# EAGLE schematic u2x (EAGLE 9.6.1)
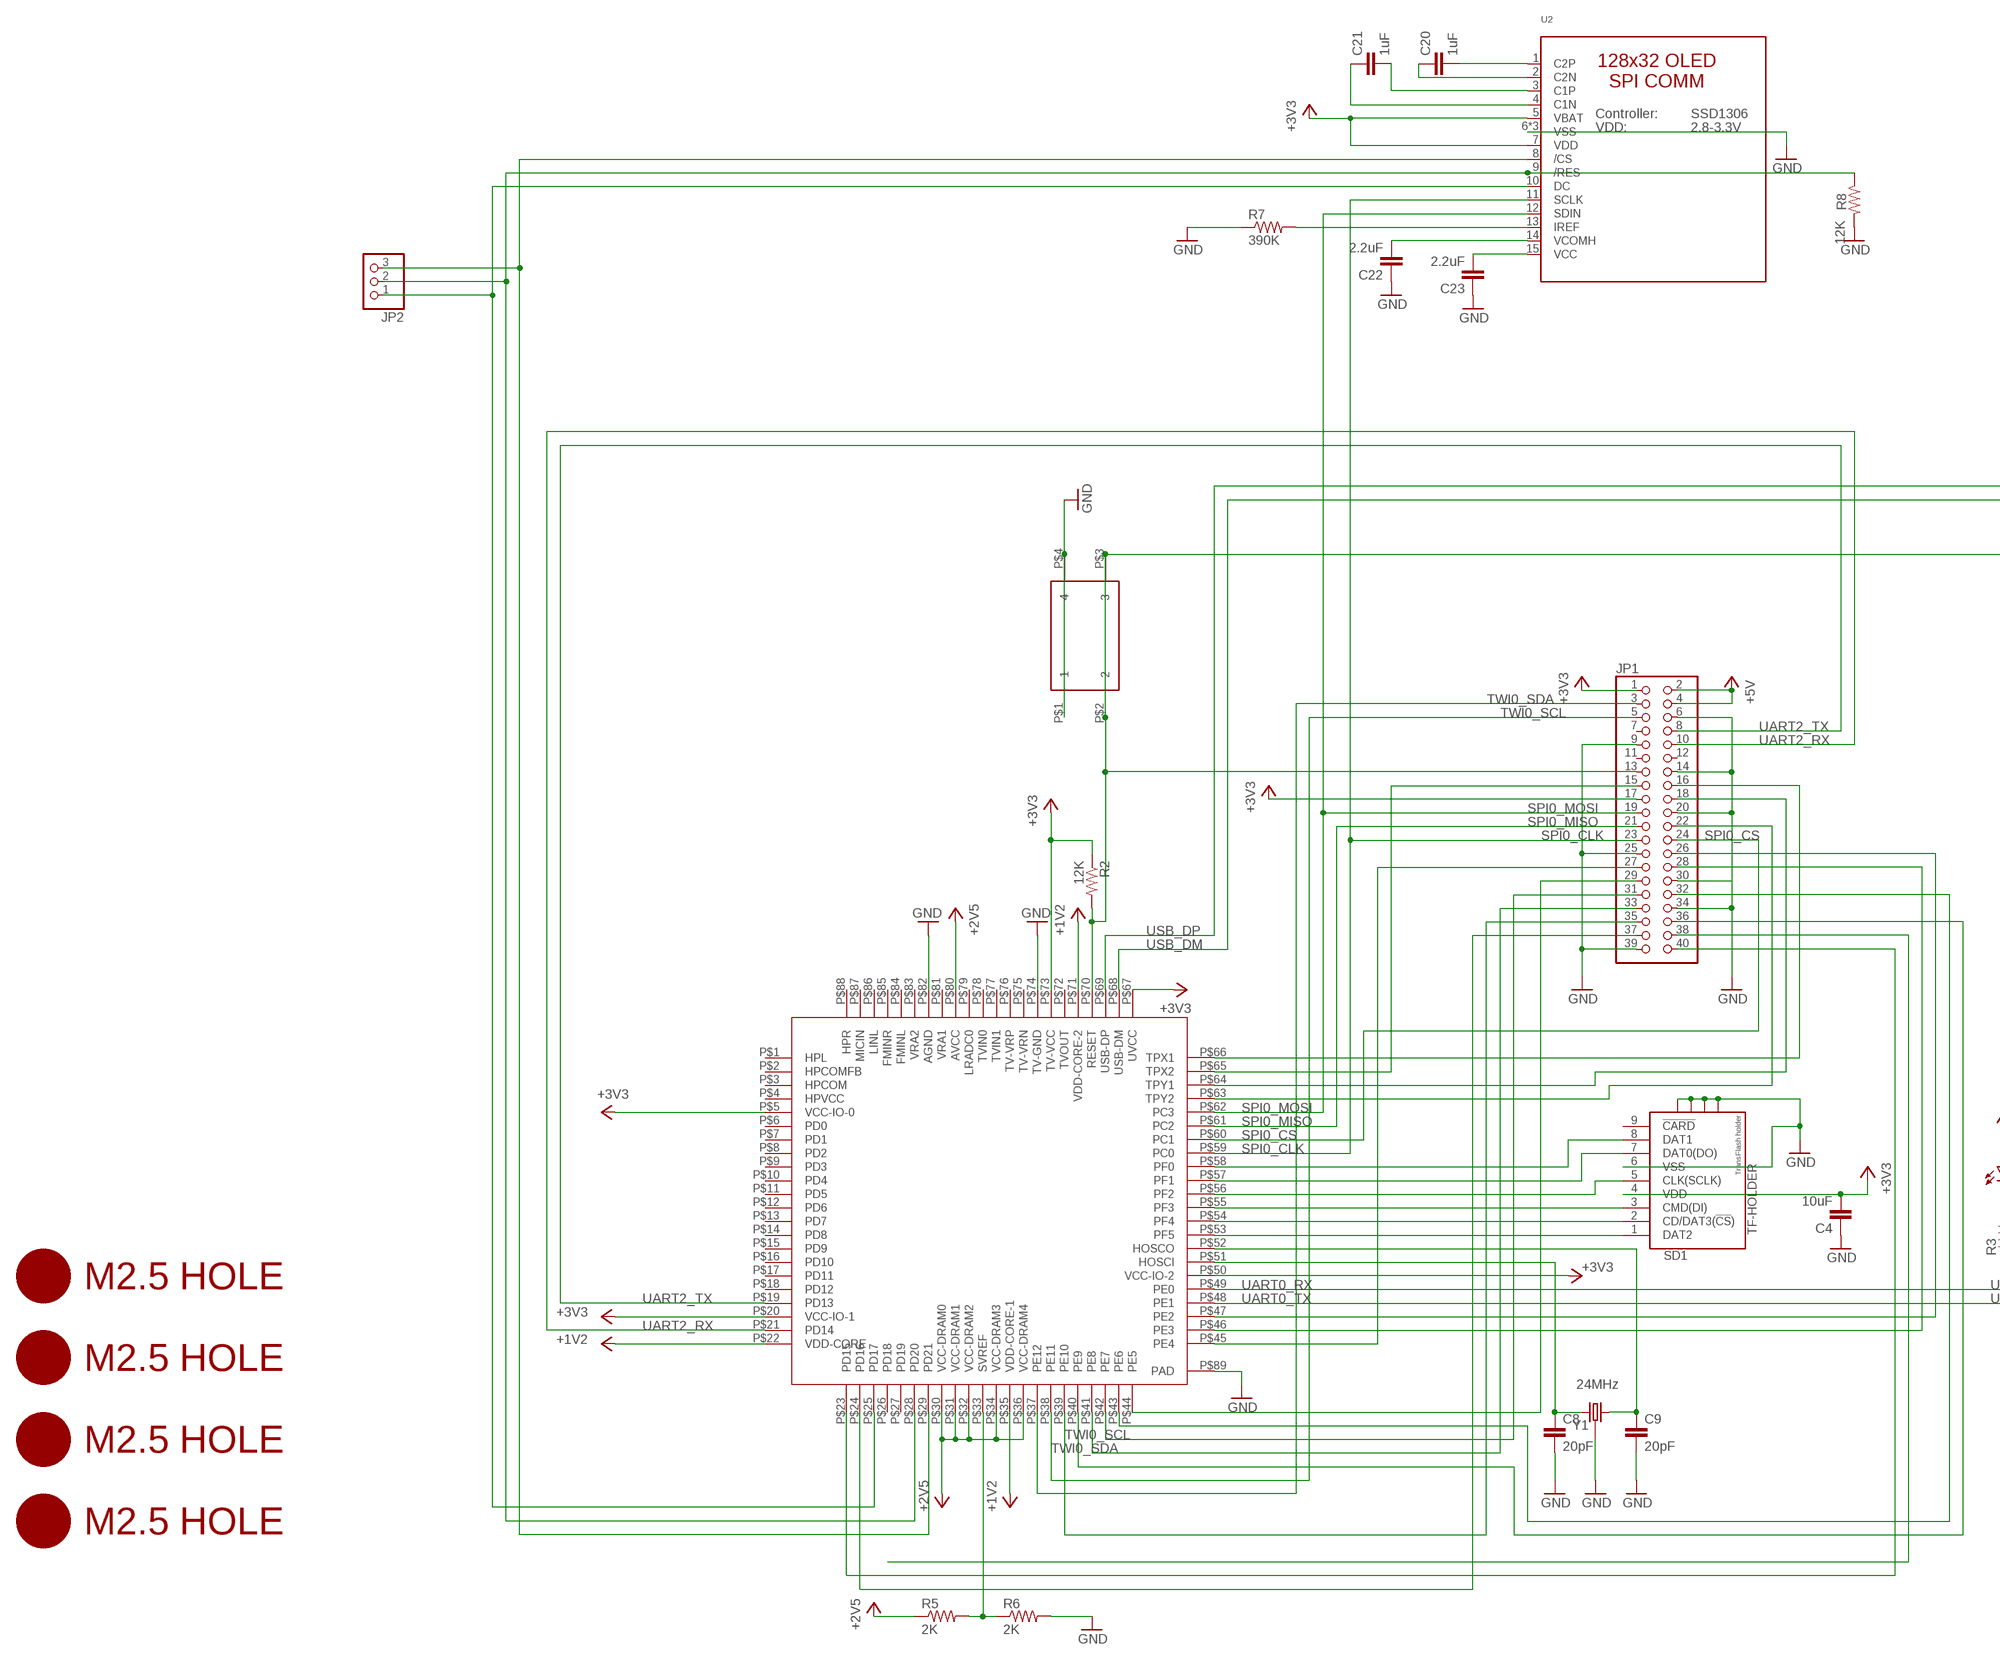
[diagram p0: schematic, sheet 1, part 1 of 2]
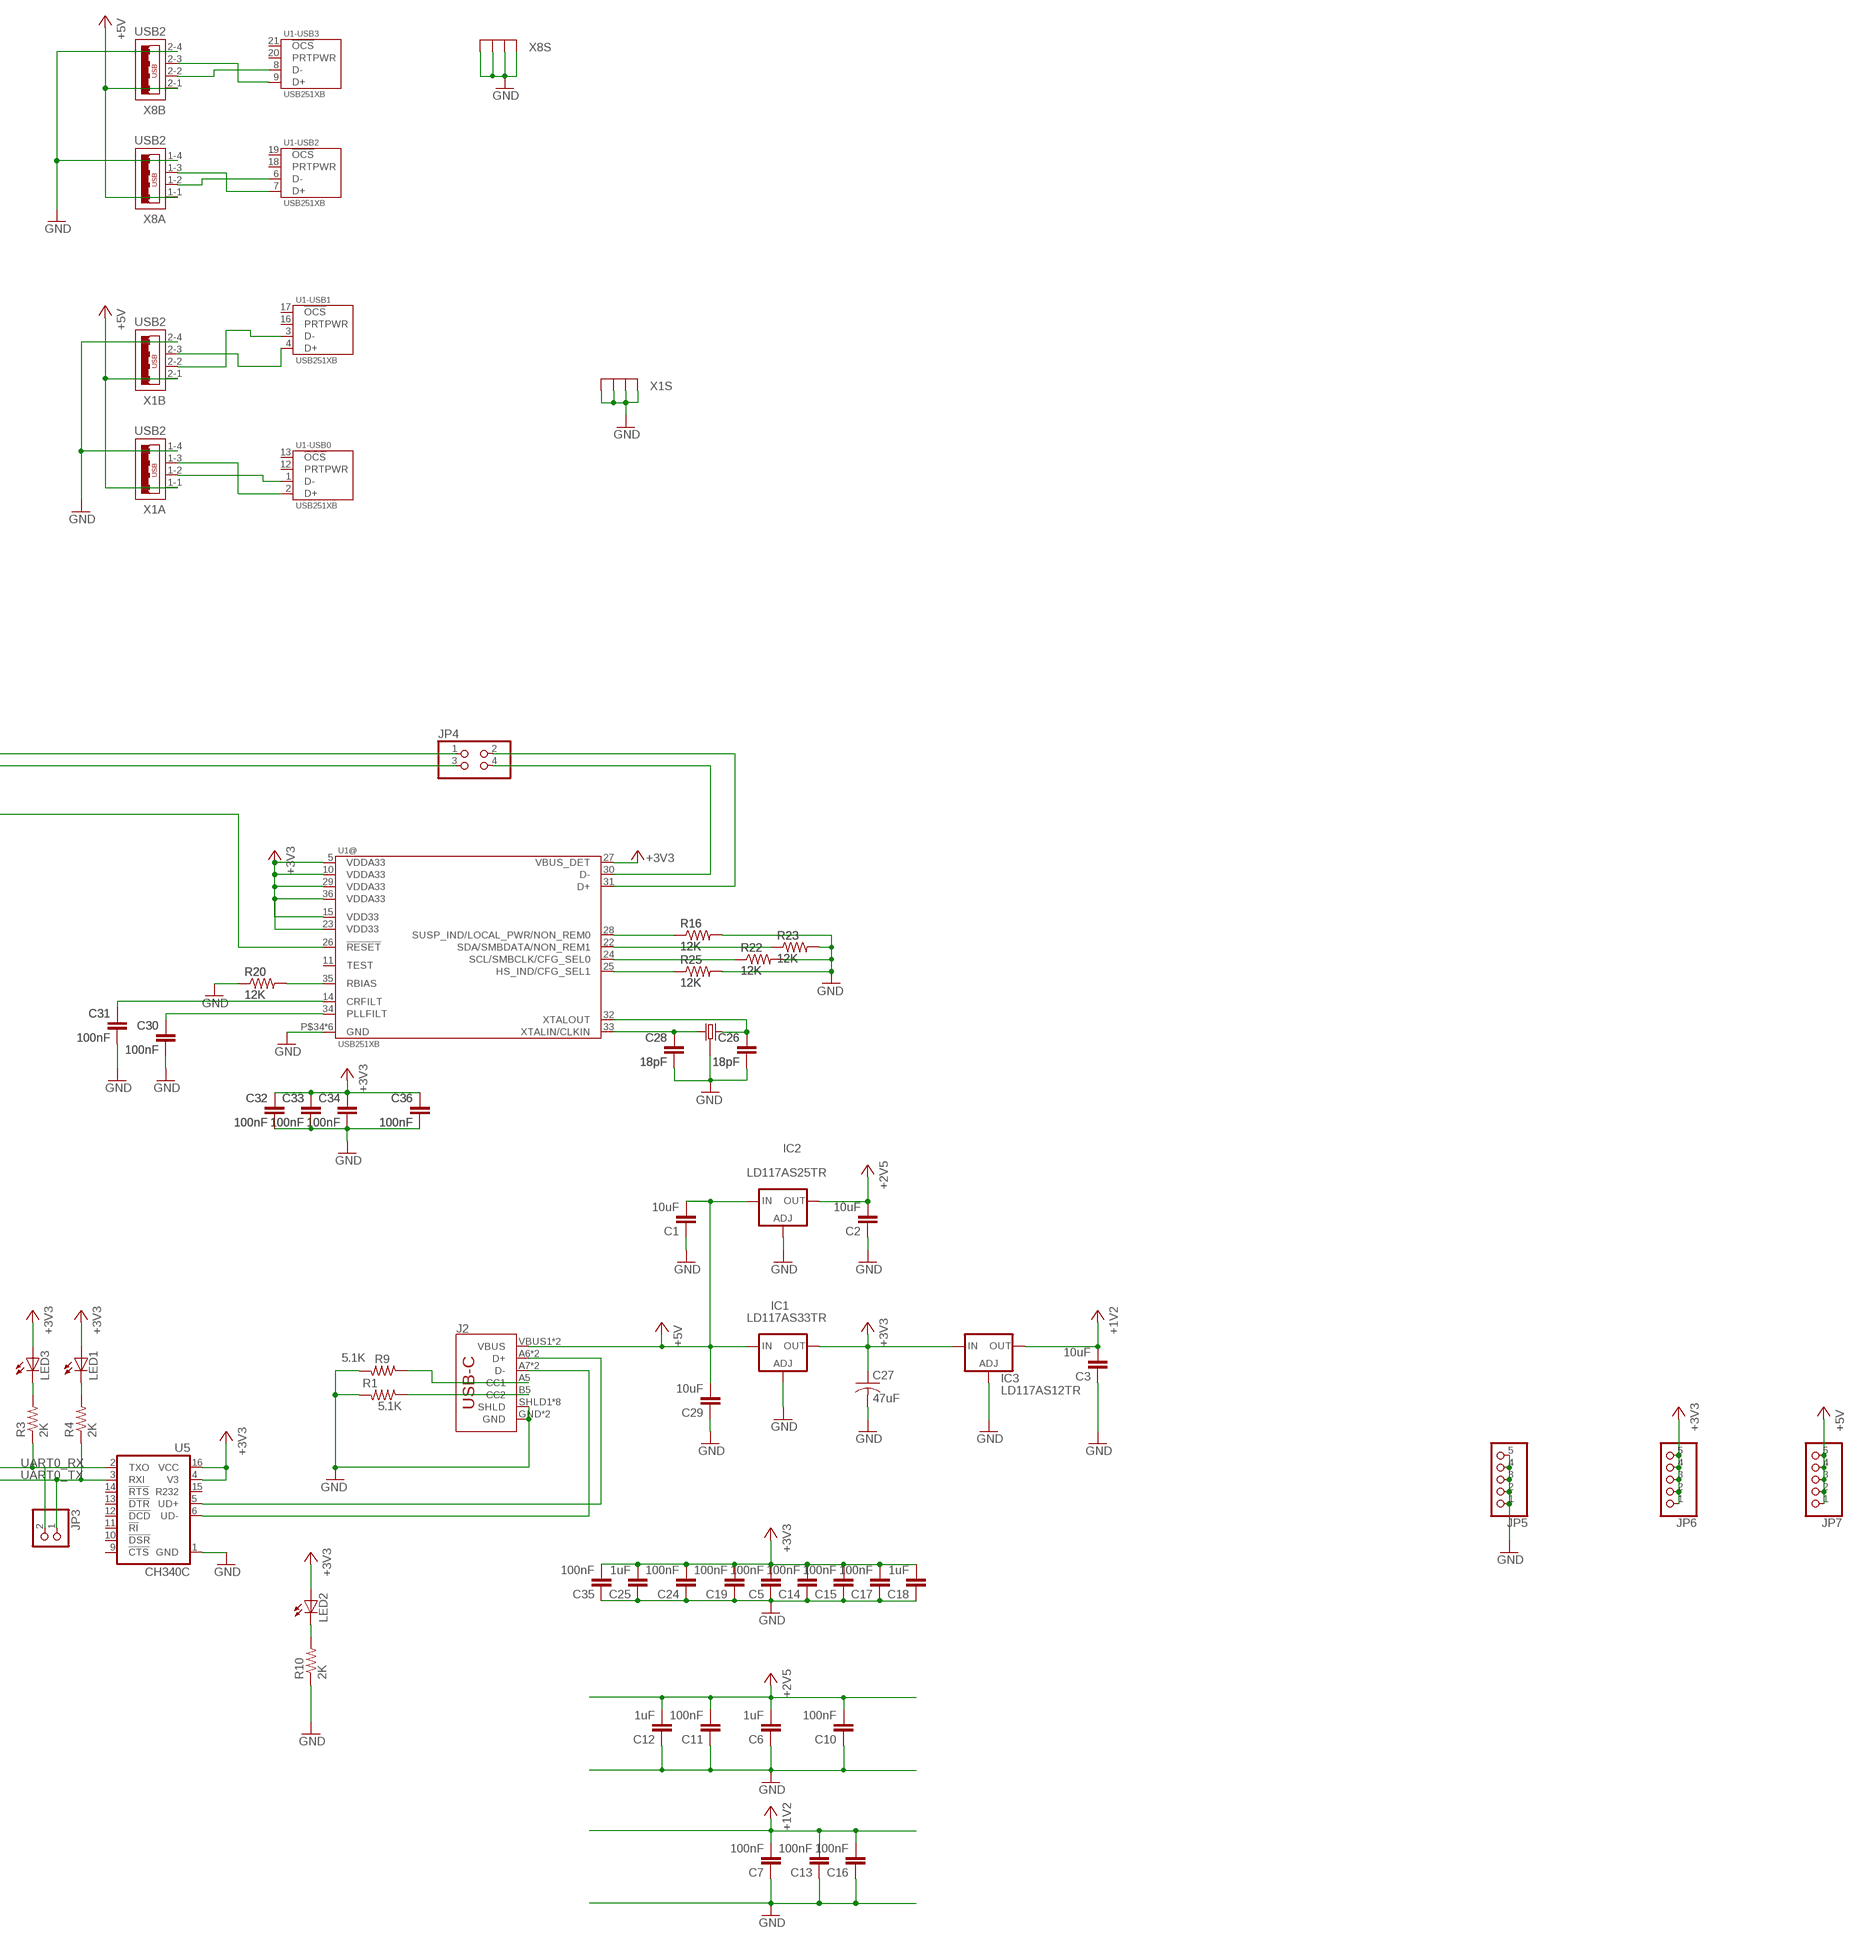
[diagram p1: schematic, sheet 1, part 2 of 2]

## Parts
C1  10uF  CAP0805  [0805]
C2  10uF  CAP0805  [0805]
C3  10uF  CAP0805  [0805]
C4  10uF  CAP0805  [0805]
C5  100nF  CAP0805  [0805]
C6  1uF  CAP0805  [0805]
C7  100nF  CAP0805  [0805]
C8  20pF  CAP0805  [0805]
C9  20pF  CAP0805  [0805]
C10  100nF  CAP0805  [0805]
C11  100nF  CAP0805  [0805]
C12  1uF  CAP0805  [0805]
C13  100nF  CAP0805  [0805]
C14  100nF  CAP0805  [0805]
C15  100nF  CAP0805  [0805]
C16  100nF  CAP0805  [0805]
C17  100nF  CAP0805  [0805]
C18  1uF  CAP0805  [0805]
C19  100nF  CAP0805  [0805]
C20  1uF  CAP0805  [0805]
C21  1uF  CAP0805  [0805]
C22  2.2uF  CAP0805  [0805]
C23  2.2uF  CAP0805  [0805]
C24  100nF  CAP0805  [0805]
C25  1uF  CAP0805  [0805]
C26  18pF  CAP0805  [0805]
C27  47uF  C-USC1210  [C1210]
C28  18pF  CAP0805  [0805]
C29  10uF  CAP0805  [0805]
C30  100nF  CAP0805  [0805]
C31  100nF  CAP0805  [0805]
C32  100nF  CAP0805  [0805]
C33  100nF  CAP0805  [0805]
C34  100nF  CAP0805  [0805]
C35  100nF  CAP0805  [0805]
C36  100nF  CAP0805  [0805]
IC1  LD117AS33TR  [SOT223]
IC2  LD117AS25TR  [SOT223]
IC3  LD117AS12TR  [SOT223]
J2  USB_C16PIN  [USB-C-16P]
JP1  PINHD-2X20-BIG  [2X20-BIG]
JP2  PINHD-1X3CB  [1X03-CLEANBIG]
JP3  PINHD-1X2  [1X02]
JP4  PINHD-2X2  [2X02]
JP5  PINHD-1X5  [1X05]
JP6  PINHD-1X5  [1X05]
JP7  PINHD-1X5  [1X05]
LED1  LEDCHIP-LED0805  [CHIP-LED0805]
LED2  LEDCHIP-LED0805  [CHIP-LED0805]
LED3  LEDCHIP-LED0805  [CHIP-LED0805]
R1  5.1K  RESISTOR0805-RES  [0805]
R2  12K  RESISTOR0805-RES  [0805]
R3  2K  RESISTOR0805-RES  [0805]
R4  2K  RESISTOR0805-RES  [0805]
R5  2K  RESISTOR0805-RES  [0805]
R6  2K  RESISTOR0805-RES  [0805]
R7  390K  RESISTOR0805-RES  [0805]
R8  12K  RESISTOR0805-RES  [0805]
R9  5.1K  RESISTOR0805-RES  [0805]
R10  2K  RESISTOR0805-RES  [0805]
R16  12K  RESISTOR0805-RES  [0805]
R20  12K  RESISTOR0805-RES  [0805]
R22  12K  RESISTOR0805-RES  [0805]
R23  12K  RESISTOR0805-RES  [0805]
R25  12K  RESISTOR0805-RES  [0805]
SD1  TF-HOLDER  [TF-PULL]
SW20  324_SW  [342_SWICH_FOOT]
U1  USB251XB  [QFN-36]
U2  LUL_DISP_OLED_UG-2864HSWEG01  [LUL_UG-2864HSWEG01_1.3_WRAPAROUND]
U5  CH340C  [SO016]
U$1  F1C100S_DEV  [MQFN88]
U$2  M2.5HOLE  [M2.5HOLE]
U$3  M2.5HOLE  [M2.5HOLE]
U$4  M2.5HOLE  [M2.5HOLE]
U$5  M2.5HOLE  [M2.5HOLE]
U$16  CRYSTAL-GROUNDED  [CRYSTAL-SMD-5X3]
X1  USB2  [USB2]
X8  USB2  [USB2]
Y1  24MHz  CRYSTAL-26MHZSMD-3.2X2.5  [CRYSTAL-SMD-3.2X2.5MM]

## Nets
+1V2: C3.2 C7.2 C13.2 C16.2 IC3.4(OUT) U$1.P$22(VDD-CORE) U$1.P$35(VDD-CORE-1) U$1.P$71(VDD-CORE-2)
+2V5: C2.2 C6.2 C10.2 C11.2 C12.2 IC2.4(OUT) R5.1 U$1.P$30(VCC-DRAM0) U$1.P$31(VCC-DRAM1) U$1.P$32(VCC-DRAM2) U$1.P$34(VCC-DRAM3) U$1.P$36(VCC-DRAM4) U$1.P$80(AVCC)
+3V3: C4.2 C5.2 C14.2 C15.2 C17.2 C18.2 C19.2 C24.2 C25.2 C27.1 C32.1 C33.1 C34.1 C35.2 C36.1 IC1.4(OUT) IC3.3(IN) JP1.1 JP1.17 JP6.1 JP6.2 JP6.3 JP6.4 JP6.5 LED1.A LED2.A LED3.A R2.1 SD1.4(VDD) U1.5(@:VDDA33) U1.10(@:VDDA33) U1.15(@:VDD33) U1.23(@:VDD33) U1.27(@:VBUS_DET) U1.29(@:VDDA33) U1.36(@:VDDA33) U2.5(VBAT) U2.7(VDD) U5.4(V3) U5.16(VCC) U$1.P$5(VCC-IO-0) U$1.P$20(VCC-IO-1) U$1.P$50(VCC-IO-2) U$1.P$67(UVCC) U$1.P$73(TV-VCC)
+5V: C1.2 C29.2 IC1.3(IN) IC2.3(IN) J2.VBUS1(VBUS) J2.VBUS2(VBUS) JP1.2 JP1.4 JP7.1 JP7.2 JP7.3 JP7.4 JP7.5 X1.1-1 X1.2-1 X8.1-1 X8.2-1
GND: C1.1 C2.1 C3.1 C4.1 C5.1 C6.1 C7.1 C8.2 C9.2 C10.1 C11.1 C12.1 C13.1 C14.1 C15.1 C16.1 C17.1 C18.1 C19.1 C22.1 C23.1 C24.1 C25.1 C26.2 C27.2 C28.2 C29.1 C30.2 C31.2 C32.2 C33.2 C34.2 C35.1 C36.2 IC1.1(ADJ) IC2.1(ADJ) IC3.1(ADJ) J2.GND J2.GND2(GND) J2.SHLD1(SHLD) J2.SHLD2(SHLD) J2.SHLD3(SHLD) J2.SHLD4(SHLD) J2.SHLD5(SHLD) J2.SHLD6(SHLD) J2.SHLD7(SHLD) J2.SHLD8(SHLD) JP1.6 JP1.9 JP1.14 JP1.20 JP1.25 JP1.30 JP1.34 JP1.39 JP5.1 JP5.2 JP5.3 JP5.4 JP5.5 R1.2 R6.2 R7.1 R8.2 R9.2 R10.1 R16.2 R20.1 R22.2 R23.2 R25.2 SD1.6(VSS) SD1.S1 SD1.S2 SD1.S3 SD1.S4 SW20.P$1 SW20.P$4 U1.P$34(@:GND) U1.P$35(@:GND) U1.P$36(@:GND) U1.P$37(@:GND) U1.P$38(@:GND) U1.PAD(@:GND) U2.6(VSS) U2.16(VSS) U2.17(VSS) U5.1(GND) U$1.P$74(TV-GND) U$1.P$82(AGND) U$1.P$89(PAD) U$16.2 U$16.4 X1.1-4 X1.2-4 X1.M1(S:S1) X1.M2(S:S2) X1.M3(S:S3) X1.M4(S:S4) X8.1-4 X8.2-4 X8.M1(S:S1) X8.M2(S:S2) X8.M3(S:S3) X8.M4(S:S4) Y1.2 Y1.4
N$1: SD1.8(DAT1) U$1.P$58(PF0)
N$2: J2.A5(CC1) R9.1
N$3: C8.1 U$1.P$51(HOSCI) Y1.1
N$4: C9.1 U$1.P$52(HOSCO) Y1.3
N$5: LED1.C R4.2
N$6: LED3.C R3.2
N$7: J2.B5(CC2) R1.1
N$8: SD1.7(DAT0(DO)) U$1.P$57(PF1)
N$9: SD1.5(CLK(SCLK)) U$1.P$56(PF2)
N$10: SD1.3(CMD(DI)) U$1.P$55(PF3)
N$11: SD1.2(CD/DAT3(!CS!)) U$1.P$54(PF4)
N$12: SD1.1(DAT2) U$1.P$53(PF5)
N$13: U1.2(-USB0:D+) X1.1-3
N$14: R5.2 R6.1 U$1.P$33(SVREF)
N$15: U1.1(-USB0:D-) X1.1-2
N$16: J2.A6(D+) J2.B6(D+) U5.5(UD+)
N$17: JP1.13 R2.2 SW20.P$2 SW20.P$3 U1.26(@:!RESET) U$1.P$70(RESET)
N$18: J2.A7(D-) J2.B7(D-) U5.6(UD-)
N$19: JP1.26 U$1.P$47(PE2)
N$20: JP1.28 U$1.P$46(PE3)
N$21: JP1.27 U$1.P$45(PE4)
N$22: JP1.18 U$1.P$64(TPY1)
N$23: JP1.22 U$1.P$63(TPY2)
N$24: JP1.15 U$1.P$65(TPX2)
N$25: JP1.16 U$1.P$66(TPX1)
N$26: JP1.29 U$1.P$44(PE5)
N$27: JP1.32 U$1.P$43(PE6)
N$28: JP1.31 U$1.P$42(PE7)
N$29: JP1.33 U$1.P$41(PE8)
N$30: JP1.36 U$1.P$40(PE9)
N$31: JP1.35 U$1.P$39(PE10)
N$32: JP1.38
N$33: JP1.40 U$1.P$23(PD15)
N$34: JP1.37 U$1.P$24(PD16)
N$35: C20.2 U2.1(C2P)
N$36: C20.1 U2.2(C2N)
N$37: C21.2 U2.3(C1P)
N$38: C21.1 U2.4(C1N)
N$39: R7.2 U2.13(IREF)
N$40: C22.2 U2.14(VCOMH)
N$41: C23.2 U2.15(VCC)
N$42: JP2.3 U2.8(/CS) U$1.P$29(PD21)
N$43: JP2.2 R8.1 U2.9(/RES) U$1.P$28(PD20)
N$44: JP2.1 U2.10(DC) U$1.P$25(PD17)
N$45: U1.4(-USB1:D+) X1.2-3
N$46: U1.3(-USB1:D-) X1.2-2
N$47: U1.6(-USB2:D-) X8.1-2
N$48: U1.7(-USB2:D+) X8.1-3
N$49: U1.8(-USB3:D-) X8.2-2
N$50: U1.9(-USB3:D+) X8.2-3
N$51: JP4.4 U1.30(@:D-)
N$52: JP4.2 U1.31(@:D+)
N$53: LED2.C R10.2
N$78: R20.2 U1.35(@:RBIAS)
N$81: C28.1 U1.33(@:XTALIN/CLKIN) U$16.1
N$82: C26.1 U1.32(@:XTALOUT) U$16.3
N$89: C31.1 U1.14(@:CRFILT)
N$90: C30.1 U1.34(@:PLLFILT)
N$92: R16.1 U1.28(@:SUSP_IND/LOCAL_PWR/NON_REM0)
N$93: R25.1 U1.25(@:HS_IND/CFG_SEL1)
N$94: R23.1 U1.22(@:SDA/SMBDATA/NON_REM1)
N$96: R22.1 U1.24(@:SCL/SMBCLK/CFG_SEL0)
SPI0_CLK: JP1.23 U2.11(SCLK) U$1.P$59(PC0)
SPI0_CS: JP1.24 U$1.P$60(PC1)
SPI0_MISO: JP1.21 U$1.P$61(PC2)
SPI0_MOSI: JP1.19 U2.12(SDIN) U$1.P$62(PC3)
TWI0_SCL: JP1.5 U$1.P$38(PE11)
TWI0_SDA: JP1.3 U$1.P$37(PE12)
UART0_RX: JP3.2 R3.1 U5.2(TXO) U$1.P$49(PE0)
UART0_TX: JP3.1 R4.1 U5.3(RXI) U$1.P$48(PE1)
UART2_RX: JP1.10 U$1.P$21(PD14)
UART2_TX: JP1.8 U$1.P$19(PD13)
USB_DM: JP4.3 U$1.P$68(USB-DM)
USB_DP: JP4.1 U$1.P$69(USB-DP)
Unconnected: JP1.7 JP1.11 JP1.12 SD1.9(!CARD) U1.11(@:TEST) U1.12(-USB0:PRTPWR) U1.13(-USB0:!OCS) U1.16(-USB1:PRTPWR) U1.17(-USB1:!OCS) U1.18(-USB2:PRTPWR) U1.19(-USB2:!OCS) U1.20(-USB3:PRTPWR) U1.21(-USB3:!OCS) U5.9(!CTS) U5.10(!DSR) U5.11(!RI) U5.12(!DCD) U5.13(!DTR) U5.14(!RTS) U5.15(R232) U$1.P$1(HPL) U$1.P$2(HPCOMFB) U$1.P$3(HPCOM) U$1.P$4(HPVCC) U$1.P$6(PD0) U$1.P$7(PD1) U$1.P$8(PD2) U$1.P$9(PD3) U$1.P$10(PD4) U$1.P$11(PD5) U$1.P$12(PD6) U$1.P$13(PD7) U$1.P$14(PD8) U$1.P$15(PD9) U$1.P$16(PD10) U$1.P$17(PD11) U$1.P$18(PD12) U$1.P$26(PD18) U$1.P$27(PD19) U$1.P$72(TVOUT) U$1.P$75(TV-VRN) U$1.P$76(TV-VRP) U$1.P$77(TVIN1) U$1.P$78(TVIN0) U$1.P$79(LRADC0) U$1.P$81(VRA1) U$1.P$83(VRA2) U$1.P$84(FMINL) U$1.P$85(FMINR) U$1.P$86(LINL) U$1.P$87(MICIN) U$1.P$88(HPR)

## Library data of the parts
C1-C25 C29 C35 = clock:CAP: Capacitor Standard 0603 ceramic capacitor, and 0.1" leaded capacitor.
C26 C28 C30-C34 C36 = joyAnalog:CAP: Capacitor Standard 0603 ceramic capacitor, and 0.1" leaded capacitor.
C27 = clock:C-US: CAPACITOR, American symbol
IC1-IC3 = v-reg:LD117A?*: Low drop fixed and adjustable positive voltage regulators 1 A Source: http://www.st.com/stonline/products/literature/ds/7194/ld1117axx.pdf
J2 = SparkFun-Connectors:USB_C: USB Type C 16Pin Connector Super Speed pins not available on the 16-pin purely SMD connector so this part is best for USB 2.0 implementations. D1 and D2 are tied together enabling D+/- no matter which way the cable is plugged into the connector. The two channel configuration pins (CC1/2) are exposed. These are normally connected to ground via 5.1k resistors but can be reconfigured for high current/high power applications.; PROD_ID: CONN-14122
JP1 = adafruit_changed:PINHD-2X20: PIN HEADER
JP2 = adafruit_changed:PINHD-1X3: PIN HEADER
JP3 = pinhead:PINHD-1X2: PIN HEADER
JP4 = pinhead:PINHD-2X2: PIN HEADER
JP5-JP7 = pinhead:PINHD-1X5: PIN HEADER
LED1-LED3 = adafruit:LED: LED OSRAM: - CHIPLED LG R971, LG N971, LY N971, LG Q971, LY Q971, LO R971, LY R971 LH N974, LH R974 LS Q976, LO Q976, LY Q976 LO Q996 - Hyper CHIPLED LW Q18S LB Q993, LB Q99A, LB R99A - SideLED LS A670, LO A670, LY A670, LG A670, LP A670 LB A673, LV A673, LT A673, LW A673 LH A674 LY A675 LS A676, LA A676, LO A676, LY A676, LW A676 LS A679, LY A679, LG A679 - Hyper Micro SIDELED® LS Y876, LA Y876, LO Y876, LY Y876 LT Y87S - SmartLED LW L88C, LW L88S LB L89C, LB L89S, LG L890 LS L89K, LO L89K, LY L89K LS L896, LA L896, LO L896, LY L896 - TOPLED LS T670, LO T670, LY T670, LG T670, LP T670 LSG T670, LSP T670, LSY T670, LOP T670, LYG T670 LG T671, LOG T671, LSG T671 LB T673, LV T673, LT T673, LW T673 LH T674 LS T676, LA T676, LO T676, LY T676, LB T676, LH T676, LSB T676, LW T676 LB T67C, LV T67C, LT T67C, LS T67K, LO T67K, LY T67K, LW E67C LS E67B, LA E67B, LO E67B, LY E67B, LB E67C, LV E67C, LT E67C LW T67C LS T679, LY T679, LG T679 LS T770, LO T770, LY T770, LG T770, LP T770 LB T773, LV T773, LT T773, LW T773 LH T774 LS E675, LA E675, LY E675, LS T675 LS T776, LA T776, LO T776, LY T776, LB T776 LHGB T686 LT T68C, LB T68C - Hyper Mini TOPLED® LB M676 - Mini TOPLED Santana® LG M470 LS M47K, LO M47K, LY M47K Source: http://www.osram.convergy.de/
R1 R8 R9 R16 R20 R22 R23 R25 = joyAnalog:RESISTOR: Resistor Basic schematic elements and footprints for 0603, 1206, and PTH resistors.
R2-R7 R10 = SparkFun-Passives:RESISTOR: Resistor Basic schematic elements and footprints for 0603, 1206, and PTH resistors.
SD1 = clock:TF-HOLDER: TF / Micro SD socket is PUSH-PUSH type, the card can be pushed into and auto locked and pushed out by simply press the card. Surface Mounting type.
SW20 = 3pos_slide_switch_centered:324_SW
U1 = Microchip:USB251X
U2 = lul:LUL_DISP_OLED_UG-2864HSWEG01: UG-2864HSWEG01 OLED display Both 1.3" and 0.96" models share the same FPC tab footprint, only the screen dimensions vary.
U5 = SparkFun-IC-Comms:CH340C; PROD_ID: IC-14038
U$1 = f1c100s:F1C100S_DEV
U$2-U$5 = f1c100s:M2.5HOLE
U$16 = SparkFun-FreqCtrl:CRYSTAL-GROUNDED
X1 X8 = RPB:USB2: Triple USB Connector Source: www.cypressindustries.com; OC_FARNELL: unknown; OC_NEWARK: unknown
Y1 = SparkFun-Clocks:CRYSTAL-26MHZ: 26MHz Crystal w/ Ground Pin Digikey Example <http://www.digikey.com/product-detail/en/epson/TSX-3225%2026.0000MF09Z-AC3/SER3627CT-ND/1802878> Frequency: 26MHz Frequency Stability: ±9ppm Frequency Tolerance: ±10ppm Load Capacitance: 9pF SparkFun Products: SparkFun ESP32 Thing <https://www.sparkfun.com/products/13907> SparkFun ESP8266 Thing Dev Board <https://www.sparkfun.com/products/13711>; PROD_ID: XTAL-12454

## Net classes
1 power: width 0.178 mm